# EAGLE design upconvertersch (EAGLE 9.6.2)
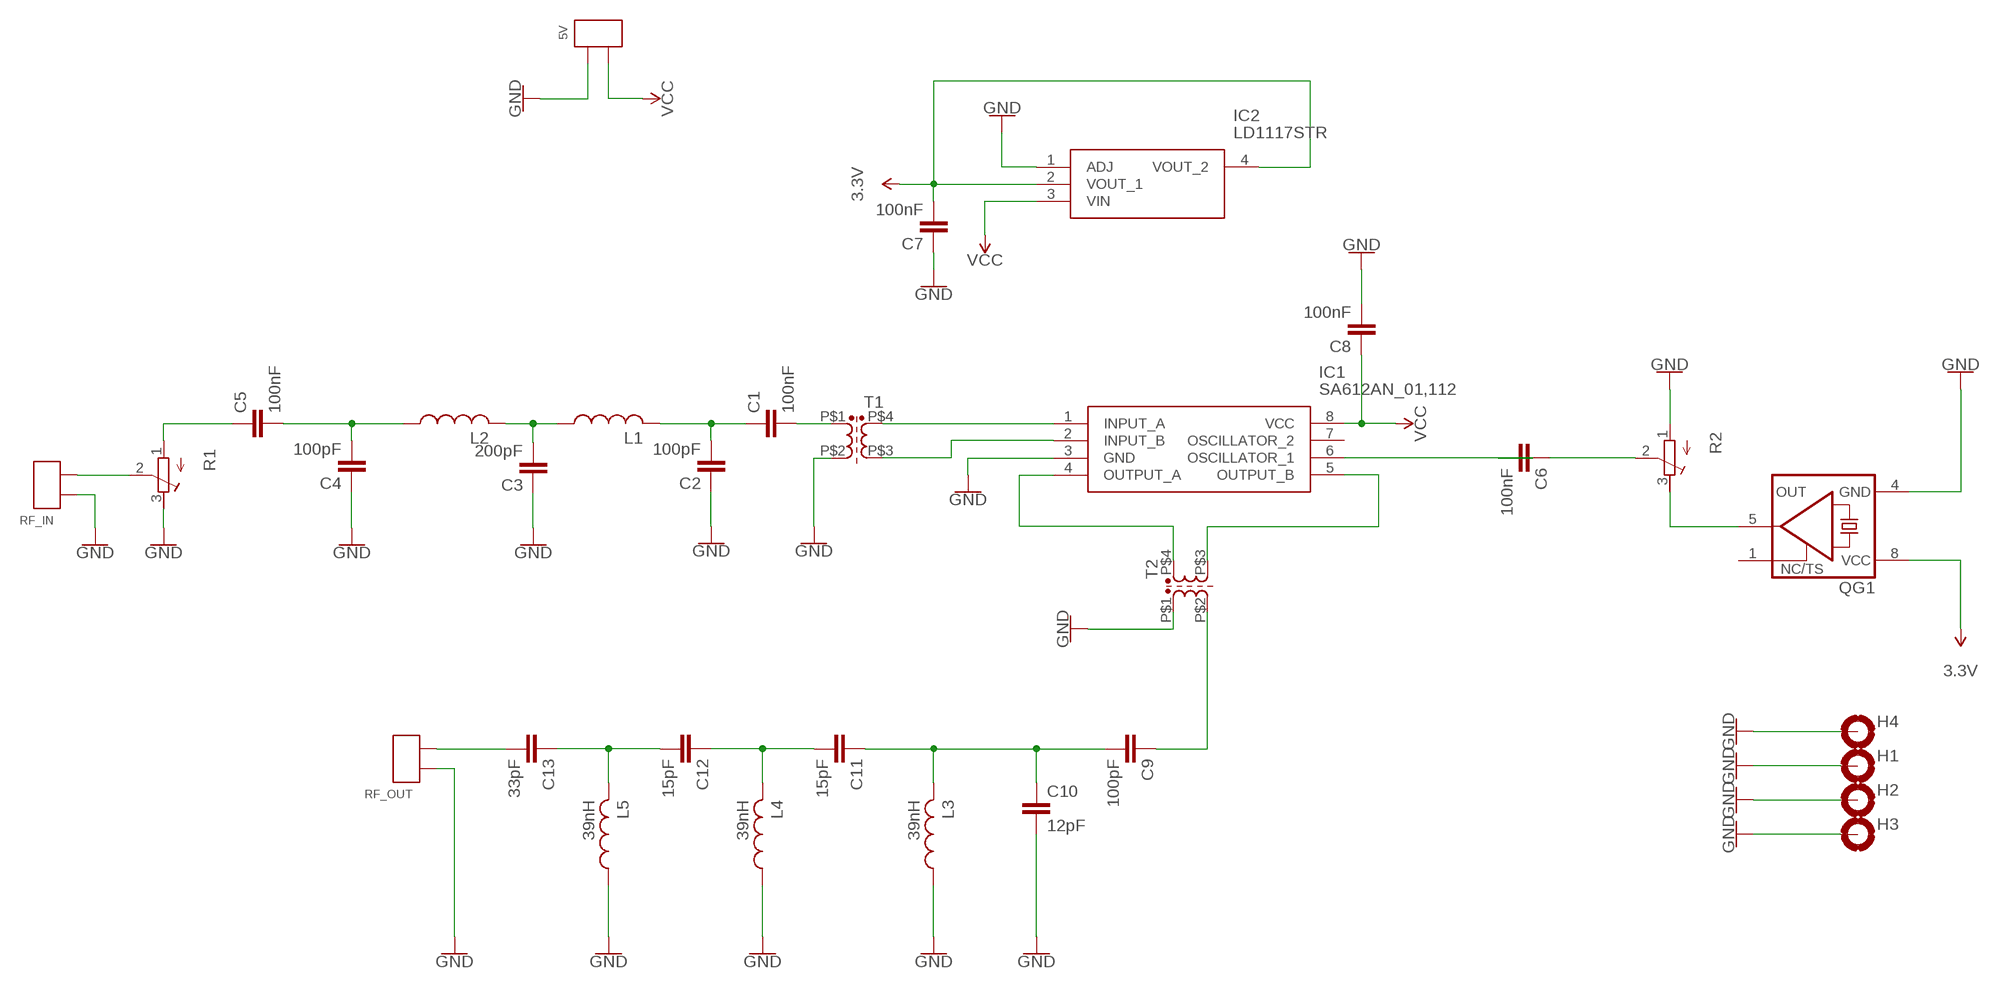
[diagram p0: schematic, sheet 1]

## Parts
5V  2X_SMD_PTH_PIN  [2X_SMD_PTH]
C1  100nF  C_0805_PTH  [C0805K]
C2  100pF  C_0805_PTH  [C0805K]
C3  200pF  C_0805_PTH  [C0805K]
C4  100pF  C_0805_PTH  [C0805K]
C5  100nF  C_0805_PTH  [C0805K]
C6  100nF  C_0805_PTH  [C0805K]
C7  100nF  C_0805_PTH  [C0805K]
C8  100nF  C_0805_PTH  [C0805K]
C9  100pF  C_0805_PTH  [C0805K]
C10  12pF  C_0805_PTH  [C0805K]
C11  15pF  C_0805_PTH  [C0805K]
C12  15pF  C_0805_PTH  [C0805K]
C13  33pF  C_0805_PTH  [C0805K]
H1  MOUNT-PAD-ROUND3.0  [3,0-PAD]
H2  MOUNT-PAD-ROUND3.0  [3,0-PAD]
H3  MOUNT-PAD-ROUND3.0  [3,0-PAD]
H4  MOUNT-PAD-ROUND3.0  [3,0-PAD]
IC1  SA612AN_01,112  [DIP762W53P254L950H420Q8N]
IC2  LD1117STR  [SOT230P700X180-4N]
L1  L_0805_PTH  [M0805]
L2  L_0805_PTH  [M0805]
L3  39nH  L_0805_PTH  [M0805]
L4  39nH  L_0805_PTH  [M0805]
L5  39nH  L_0805_PTH  [M0805]
QG1  XO-8  [DIL08S]
R1  R-TRIMM64W  [RTRIM64W]
R2  R-TRIMM64W  [RTRIM64W]
RF_IN  2X_SMD_PTH_PIN  [2X_SMD_PTH]
RF_OUT  2X_SMD_PTH_PIN  [2X_SMD_PTH]
T1  TRANSFORMER  [TRANSFORMER]
T2  TRANSFORMER  [TRANSFORMER]

## Nets
3.3V: C7.2 C7.P$2 IC2.2(VOUT_1) IC2.4(VOUT_2) QG1.8(VCC)
GND: 5V.P$1(PIN0) 5V.T$1(PIN0) C2.1 C2.P$1 C3.1 C3.P$1 C4.1 C4.P$1 C7.1 C7.P$1 C8.2 C8.P$2 C10.2 C10.P$2 H1.B3,0(MOUNT) H2.B3,0(MOUNT) H3.B3,0(MOUNT) H4.B3,0(MOUNT) IC1.3(GND) IC2.1(ADJ) L3.1 L3.P$1 L4.1 L4.P$1 L5.1 L5.P$1 QG1.4(GND) R1.3(E) R2.1(A) RF_IN.P$1(PIN0) RF_IN.T$1(PIN0) RF_OUT.P$1(PIN0) RF_OUT.T$1(PIN0) T1.P$2 T2.P$1
N$1: IC1.1(INPUT_A) T1.P$4
N$2: IC1.2(INPUT_B) T1.P$3
N$3: IC1.4(OUTPUT_A) T2.P$4
N$4: IC1.5(OUTPUT_B) T2.P$3
N$5: C1.2 C1.P$2 T1.P$1
N$6: C1.1 C1.P$1 C2.2 C2.P$2 L1.2 L1.P$2
N$7: C3.2 C3.P$2 L1.1 L1.P$1 L2.2 L2.P$2
N$8: C4.2 C4.P$2 C5.2 C5.P$2 L2.1 L2.P$1
N$9: C5.1 C5.P$1 R1.1(A)
N$10: R1.2(S) RF_IN.P$2(PIN1) RF_IN.T$2(PIN1)
N$11: QG1.5(OUT) R2.3(E)
N$12: C9.1 C9.P$1 T2.P$2
N$13: C6.1 C6.P$1 R2.2(S)
N$14: C6.2 C6.P$2 IC1.6(OSCILLATOR_1)
N$15: C9.2 C9.P$2 C10.1 C10.P$1 C11.1 C11.P$1 L3.2 L3.P$2
N$16: C11.2 C11.P$2 C12.1 C12.P$1 L4.2 L4.P$2
N$17: C12.2 C12.P$2 C13.1 C13.P$1 L5.2 L5.P$2
N$18: C13.2 C13.P$2 RF_OUT.P$2(PIN1) RF_OUT.T$2(PIN1)
VCC: 5V.P$2(PIN1) 5V.T$2(PIN1) C8.1 C8.P$1 IC1.8(VCC) IC2.3(VIN)
Unconnected: IC1.7(OSCILLATOR_2) QG1.1(TS)

## Library data of the parts
5V RF_IN RF_OUT = mylib:2X_SMD_PTH_PIN
C1-C13 = mylib:C_0805_PTH
H1-H4 = holes:MOUNT-PAD-ROUND: MOUNTING PAD, round
IC1 = SA612AN_01_112:SA612AN_01,112: NXP SA612AN, Mixer Circuit Gain=17 dB 4.5 8 V 8-Pin PDIP Source: Datasheet <https://datasheet.datasheetarchive.com/originals/distributors/Datasheets_SAMA/f801acdc6cb9d9748f3d91798dd5a70c.pdf>; DESCRIPTION: NXP SA612AN, Mixer Circuit Gain=17 dB 4.5 8 V 8-Pin PDIP; HEIGHT: 4.2mm; MANUFACTURER_NAME: Nexperia; MANUFACTURER_PART_NUMBER: SA612AN/01,112; MOUSER_PART_NUMBER: 771-SA612AN/01; MOUSER_PRICE-STOCK: https://www.mouser.com/Search/Refine.aspx?Keyword=771-SA612AN%2F01
IC2 = LD1117STR:LD1117STR: LD1117STR, Low Dropout Voltage Regulator, Adjustable 1.3A, 1.25 15 V +/-1%, 4-Pin SOT-223 Source: Datasheet <http://www.st.com/st-web-ui/static/active/en/resource/technical/document/datasheet/CD00000544.pdf>; ARROW_PART_NUMBER: LD1117STR; ARROW_PRICE-STOCK: https://www.arrow.com/en/products/ld1117str/stmicroelectronics?region=nac; DESCRIPTION: LD1117STR, Low Dropout Voltage Regulator, Adjustable 1.3A, 1.25 15 V +/-1%, 4-Pin SOT-223; HEIGHT: 1.8mm; MANUFACTURER_NAME: STMicroelectronics; MANUFACTURER_PART_NUMBER: LD1117STR; MOUSER_PART_NUMBER: 511-LD1117S; MOUSER_PRICE-STOCK: https://www.mouser.co.uk/ProductDetail/STMicroelectronics/LD1117STR?qs=tZUCD5p2VWoh5188srwsAQ%3D%3D
L1-L5 = mylib:L_0805_PTH
QG1 = crystal:XO-: CRYSTAL; OC_FARNELL: unknown; OC_NEWARK: unknown
R1 R2 = rcl:R-TRIMM: Trimm resistor; SPICEMODEL: X; SPICEPREFIXL: POT
T1 T2 = mylib:TRANSFORMER

## Board
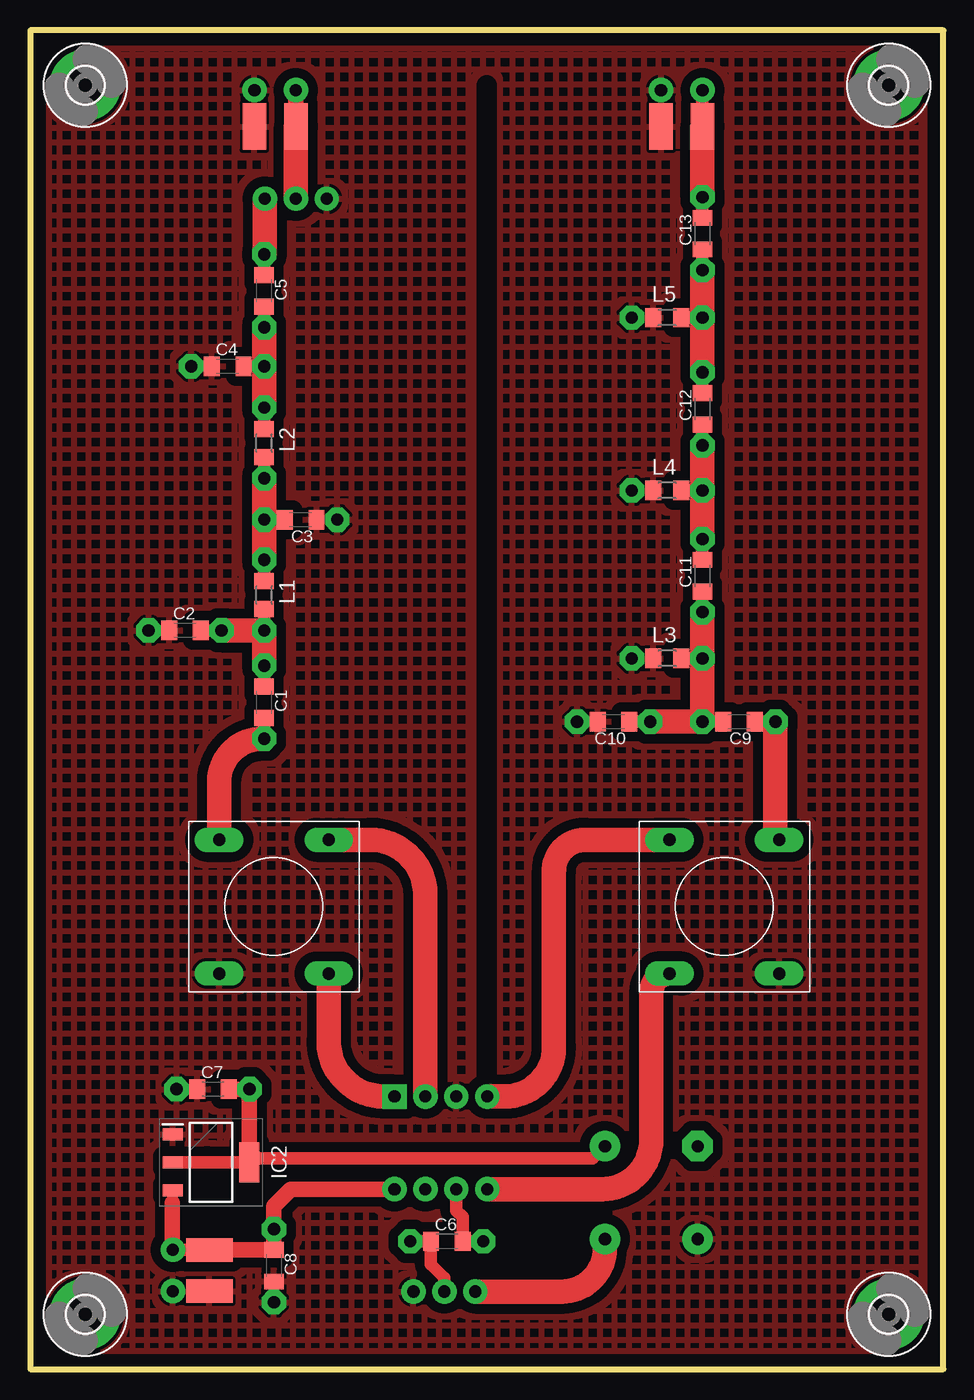
[diagram p1: board, top side]
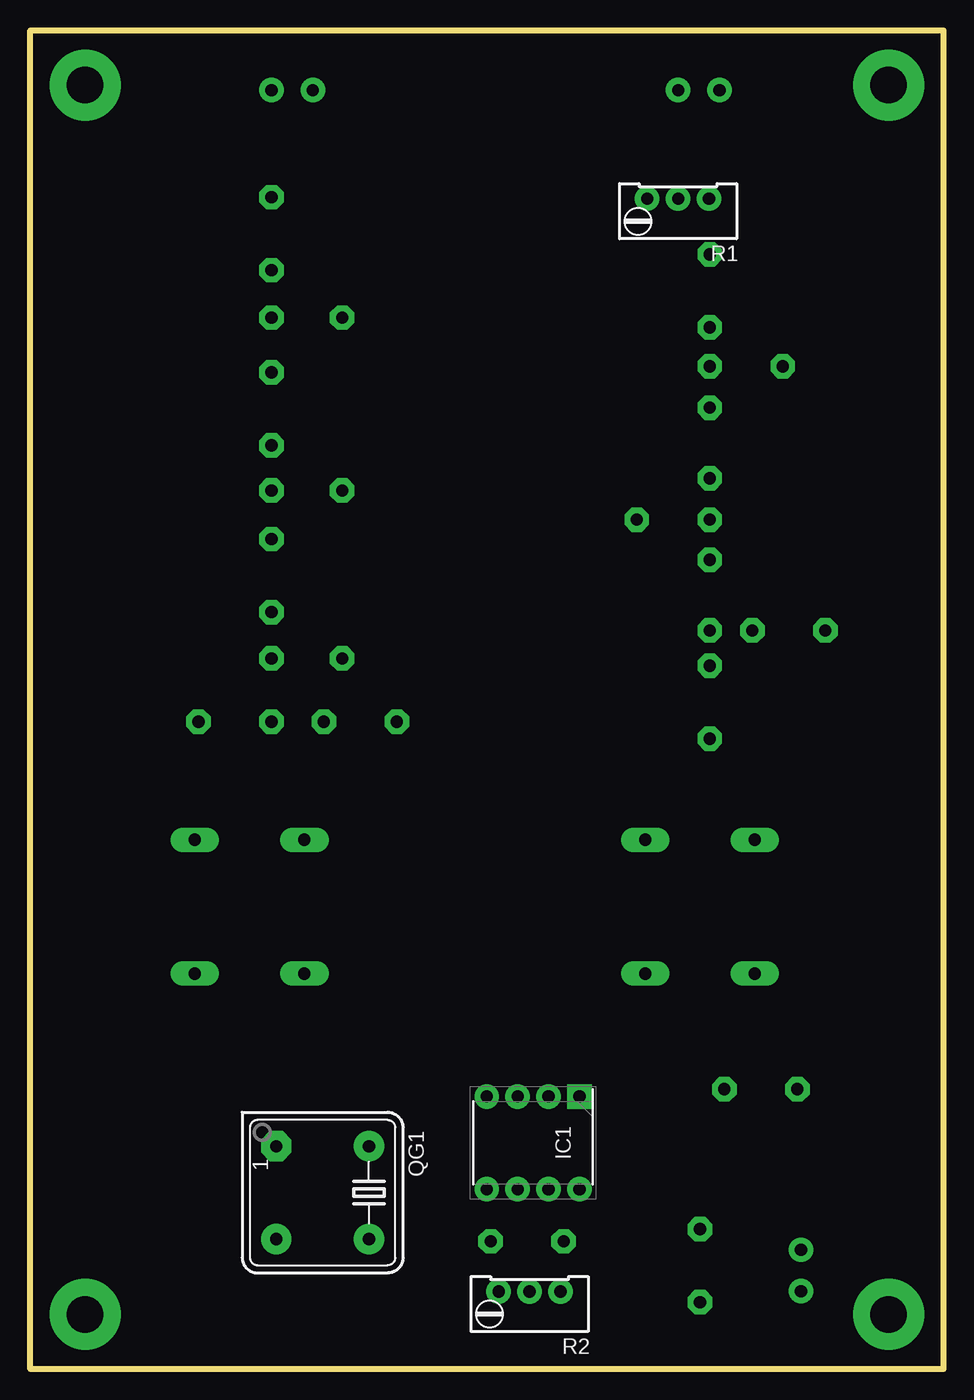
[diagram p2: board, bottom side, seen from below]

Size 75 x 110 mm. Coordinates in mm from the lower left corner, seen from the top.
Outline: 0,0 75,0 75,110 0,110 0,0
Copper layers (1*16): Top 0.035mm / dielectric 1.5mm / Bottom 0.035mm
Design rules "default": minimum track width 6mil, minimum drill 0.35mm, track to track 6mil, track to pad 6mil, pad to pad 6mil, via to via 6mil, smd to smd 6mil, copper to edge 40mil, drill to drill 6mil, minimum pad ring 10mil, minimum via ring 8mil, stop-mask expansion 4mil, vias tented up to drill 0mil, thermal gap 10mil
tRestrict: 2 lines

### Footprints (pad centres in the part's own frame; a part is rotated, then mirrored left to right if it is on the bottom)
2X_SMD_PTH = smd 3.81 x 1.93: P$1 0,1.7; P$2 0,-1.7 | drill 1 pad 2: T$1 3,1.7; T$2 3,-1.7
C0805K = smd 1.3 x 1.6: 1 -1.3,0; 2 1.3,0 | drill 1 pad 2 octagon: P$1 -3,0; P$2 3,0
3,0-PAD = drill 3 pad 5.842: B3,0 0,0
DIP762W53P254L950H420Q8N = drill 1 pad 2 square: 1 -3.81,3.81 | drill 1 pad 2: 2 -3.81,1.27; 3 -3.81,-1.27; 4 -3.81,-3.81; 5 3.81,-3.81; 6 3.81,-1.27; 7 3.81,1.27; 8 3.81,3.81
SOT230P700X180-4N = smd 1.65 x 0.95: 1 -3.15,2.3; 2 -3.15,0; 3 -3.15,-2.3 | smd 1.65 x 3.25: 4 3.15,0
M0805 = smd 1.3 x 1.6: 1 -1.15,0; 2 1.15,0 | drill 1 pad 2 octagon: P$1 -2.9,0; P$2 2.9,0
DIL08S = drill 1 pad 2.5 octagon: 1 -3.81,-3.81 | drill 1 pad 2.5: 4 3.81,-3.81; 5 3.81,3.81; 8 -3.81,3.81
RTRIM64W = drill 1 pad 2: 1 1.27,-2.54; 2 1.27,0; 3 1.27,2.54
TRANSFORMER = drill 1 pad 2 long: P$1 -4.5,5.5; P$2 -4.5,-5.5; P$3 4.5,5.5; P$4 4.5,-5.5

### Placement (x,y rotation side)
5V  14.7,8.1 180 top
C1  19.2,54.8 270 top
C2  12.7,60.7 0 top
C3  22.2,69.8 180 top
C4  16.2,82.4 0 top
C5  19.2,88.6 270 top
C6  34.2,10.5 0 top
C7  15,23 0 top
C8  20,8.5 270 top
C9  58.2,53.2 180 top
C10  47.9,53.2 180 top
C11  55.2,65.2 90 top
C12  55.2,78.9 90 top
C13  55.2,93.3 90 top
H1  4.5,4.5 0 top
H2  70.5,4.5 0 top
H3  4.5,105.5 0 top
H4  70.5,105.5 0 top
IC1  33.71,18.59 270 bottom
IC2  14.83,16.99 0 top
L1  19.2,63.6 270 top
L2  19.2,76.1 270 top
L3  52.3,58.4 0 top
L4  52.3,72.2 0 top
L5  52.3,86.4 0 top
QG1  51,14.5 270 bottom
R1  21.8,94.9 90 bottom
R2  34,5.1 90 bottom
RF_IN  20.1,102.1 90 top
RF_OUT  53.5,102.1 90 top
T1  20,38 0 top
T2  57,38 180 top

### Tracks (layer width: path | path; a pad name or v marks a point on that pad's centre or on a via)
3.3V
  Top 1.016: IC2.2 14.5,16.99 IC2.4 | IC2.4 18.49,17.5 | IC2.4 arc-90 18.3,17.31 46.19,17.31 QG1.8
  Top 1.27: IC2.4 17.98,22.98 C7.P$2 C7.2
GND
  pour Top (isolate 0.8, hatched): -1.5,112 -1.5,-2 77,-2 77,112
N$1
  Top 2: IC1.1 29.04,22.4 arc-90 24.5,26.94 T1.P$4
N$2
  Top 2: T1.P$3 27.9,43.5 arc-90 32.44,38.96 IC1.2
N$3
  Top 2: IC1.4 38.96,22.4 arc90 43,26.44 43,40.96 arc-90 45.54,43.5 T2.P$4
N$4
  Top 2: IC1.5 46.96,14.78 arc90 51,18.82 51,31 arc-90 T2.P$3
N$5
  Top 1.016: C1.P$2 C1.2
  Top 2: T1.P$1 15.5,48.26 arc-90 19.04,51.8 C1.P$2
N$6
  Top 1.016: C1.1 C1.P$1 | L1.P$2 L1.2 | C2.2 C2.P$2
  Top 2: C1.P$1 L1.P$2 C2.P$2
N$7
  Top 1.016: L1.1 L1.P$1 | C3.P$2 C3.2 | L2.P$2 L2.2
  Top 2: L1.P$1 C3.P$2 L2.P$2
N$8
  Top 1.016: L2.1 L2.P$1 | C4.P$2 C4.2 | C5.P$2 C5.2
  Top 2: L2.P$1 C4.P$2 C5.P$2
N$9
  Top 1.016: C5.1 C5.P$1
  Top 2: R1.1 19.26,91.66 C5.P$1
N$10
  Top 1.27: RF_IN.P$2 RF_IN.T$2
  Top 2: R1.2 RF_IN.P$2
N$11
  Top 2: R2.3 43.65,6.37 arc90 47.19,9.91 QG1.5
N$12
  Top 1.016: C9.1 C9.P$1
  Top 2: T2.P$2 arc-90 61.2,43.8 C9.P$1
N$13
  Top 1.016: R2.2 34,7.5 32.9,8.6 C6.1 C6.P$1
N$14
  Top 1.016: C6.P$2 C6.2 | C6.2 35.48,10.52 | C6.2 35.5,12.5 34.98,13.02 IC1.6
N$15
  Top 1.016: C10.1 C10.P$1 | C9.P$2 C9.2 | L3.2 L3.P$2 | C11.P$1 C11.1
  Top 2: C11.P$1 L3.P$2 C9.P$2 C10.P$1
N$16
  Top 1.016: C11.2 C11.P$2 | L4.2 L4.P$2 | C12.P$1 C12.1
  Top 2: C12.P$1 L4.P$2 C11.P$2
N$17
  Top 1.016: C12.2 C12.P$2 | L5.2 L5.P$2 | C13.P$1 C13.1
  Top 2: C13.P$1 L5.P$2 C12.P$2
N$18
  Top 1.016: C13.2 C13.P$2 | RF_OUT.P$2 RF_OUT.T$2
  Top 2: C13.P$2 RF_OUT.P$2
VCC
  Top 0.813: IC2.3 11.68,13.68 11.65,13.65
  Top 1.016: 5V.P$2 5V.T$2
  Top 1.27: IC1.8 21.4,14.78 20,13.38 20,13 C8.P$1 C8.1 5V.P$2 | 11.65,13.65 11.65,9.85 5V.T$2